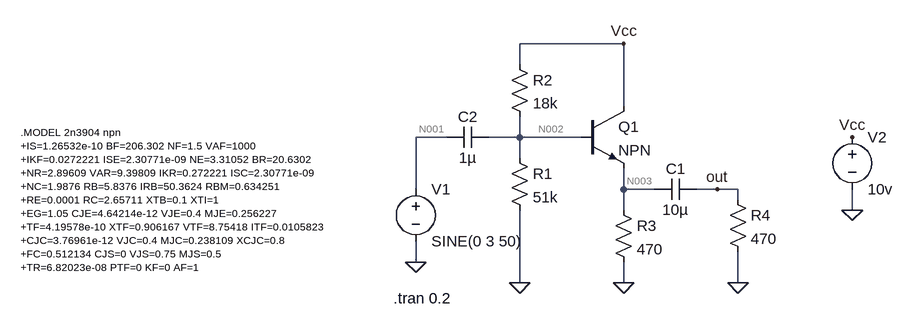
[diagram p0: schematic common_emitter_ac_signal_analysis.asc]
common_emitter_ac_signal_analysis.asc, the LTspice schematic file:
Version 4
SHEET 1 880 680
WIRE 208 32 48 32
WIRE 48 64 48 32
WIRE 208 128 208 32
WIRE -64 176 -112 176
WIRE 48 176 48 144
WIRE 48 176 0 176
WIRE 144 176 48 176
WIRE 48 208 48 176
WIRE -112 256 -112 176
WIRE 208 256 208 224
WIRE 256 256 208 256
WIRE 352 256 320 256
WIRE 384 256 352 256
WIRE 384 272 384 256
WIRE 208 288 208 256
WIRE 560 288 560 256
WIRE -112 368 -112 336
WIRE 48 400 48 288
WIRE 208 400 208 368
WIRE 384 400 384 352
FLAG 48 400 0
FLAG 208 400 0
FLAG 384 400 0
FLAG -112 368 0
FLAG 560 288 0
FLAG 560 176 Vcc
FLAG 208 32 Vcc
FLAG 352 256 out
SYMBOL npn3 144 128 R0
SYMATTR InstName Q1
SYMBOL res 32 192 R0
SYMATTR InstName R1
SYMATTR Value 51k
SYMBOL res 32 48 R0
SYMATTR InstName R2
SYMATTR Value 18k
SYMBOL res 192 272 R0
SYMATTR InstName R3
SYMATTR Value 470
SYMBOL cap 320 240 R90
WINDOW 0 0 32 VBottom 2
WINDOW 3 32 32 VTop 2
SYMATTR InstName C1
SYMATTR Value 10µ
SYMBOL res 368 256 R0
SYMATTR InstName R4
SYMATTR Value 470
SYMBOL cap 0 160 R90
WINDOW 0 0 32 VBottom 2
WINDOW 3 32 32 VTop 2
SYMATTR InstName C2
SYMATTR Value 1µ
SYMBOL voltage -112 240 R0
WINDOW 123 0 0 Left 0
WINDOW 39 0 0 Left 0
SYMATTR InstName V1
SYMATTR Value SINE(0 3 50)
SYMBOL voltage 560 160 R0
WINDOW 123 0 0 Left 0
WINDOW 39 0 0 Left 0
SYMATTR InstName V2
SYMATTR Value 10v
TEXT -146 424 Left 2 !.tran 0.2
TEXT -720 168 Left 1 !.MODEL 2n3904 npn\n+IS=1.26532e-10 BF=206.302 NF=1.5 VAF=1000\n+IKF=0.0272221 ISE=2.30771e-09 NE=3.31052 BR=20.6302\n+NR=2.89609 VAR=9.39809 IKR=0.272221 ISC=2.30771e-09\n+NC=1.9876 RB=5.8376 IRB=50.3624 RBM=0.634251\n+RE=0.0001 RC=2.65711 XTB=0.1 XTI=1\n+EG=1.05 CJE=4.64214e-12 VJE=0.4 MJE=0.256227\n+TF=4.19578e-10 XTF=0.906167 VTF=8.75418 ITF=0.0105823\n+CJC=3.76961e-12 VJC=0.4 MJC=0.238109 XCJC=0.8\n+FC=0.512134 CJS=0 VJS=0.75 MJS=0.5\n+TR=6.82023e-08 PTF=0 KF=0 AF=1

The netlist it stands for:
* common_emitter_ac_signal_analysis.asc
Q1 Vcc N002 N003 0 NPN
R1 N002 0 51k
R2 Vcc N002 18k
R3 N003 0 470
C1 out N003 10µ
R4 out 0 470
C2 N002 N001 1µ
V1 N001 0 SINE(0 3 50)
V2 Vcc 0 10v
.model NPN NPN
.model PNP PNP
.lib standard.bjt
.tran 0.2
.MODEL 2n3904 npn
+IS=1.26532e-10 BF=206.302 NF=1.5 VAF=1000
+IKF=0.0272221 ISE=2.30771e-09 NE=3.31052 BR=20.6302
+NR=2.89609 VAR=9.39809 IKR=0.272221 ISC=2.30771e-09
+NC=1.9876 RB=5.8376 IRB=50.3624 RBM=0.634251
+RE=0.0001 RC=2.65711 XTB=0.1 XTI=1
+EG=1.05 CJE=4.64214e-12 VJE=0.4 MJE=0.256227
+TF=4.19578e-10 XTF=0.906167 VTF=8.75418 ITF=0.0105823
+CJC=3.76961e-12 VJC=0.4 MJC=0.238109 XCJC=0.8
+FC=0.512134 CJS=0 VJS=0.75 MJS=0.5
+TR=6.82023e-08 PTF=0 KF=0 AF=1
.backanno
.end

* Results of the author's LTspice run, read from the files saved beside the schematic
* Operating Point, zero values left out:
*   V(vcc) = 10 V
*   V(n002) = 5.956 V
*   V(n003) = 5.12 V
*   Ic(Q1) = 10.79 mA
*   Ib(Q1) = 107.9 µA
*   Ie(Q1) = -10.89 mA
*   I(R3) = 10.89 mA
*   I(R2) = 224.7 µA
*   I(R1) = 116.8 µA
*   I(V2) = -11.01 mA
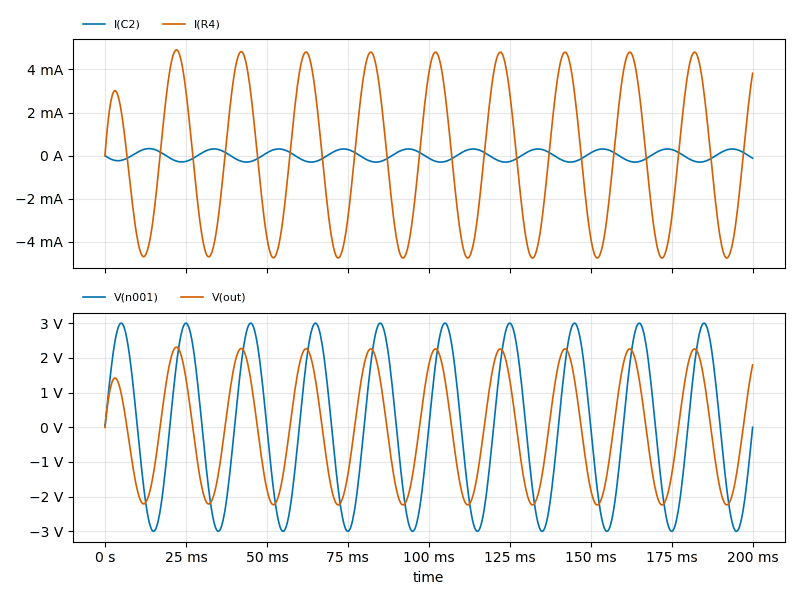
[diagram p1: Transient Analysis of common_emitter_ac_signal_analysis.asc, plotted from the saved traces]
* Transient Analysis, 1 run:
*   I(C2): min -305 µA, max 322 µA, average 4.455 µA, rms 213.8 µA, last -123 µA
*   I(R4): min -4.763 mA, max 4.912 mA, average -46.44 µA, rms 3.342 mA, last 3.822 mA
*   V(n001): min -3 V, max 3 V, average -105.8 µV, rms 2.122 V, last 0 V
*   V(out): min -2.239 V, max 2.309 V, average -21.83 mV, rms 1.571 V, last 1.796 V